# Altium schematic sheet jmb575.SchDoc
size A2; SheetNumber: 3; SheetTotal: 4
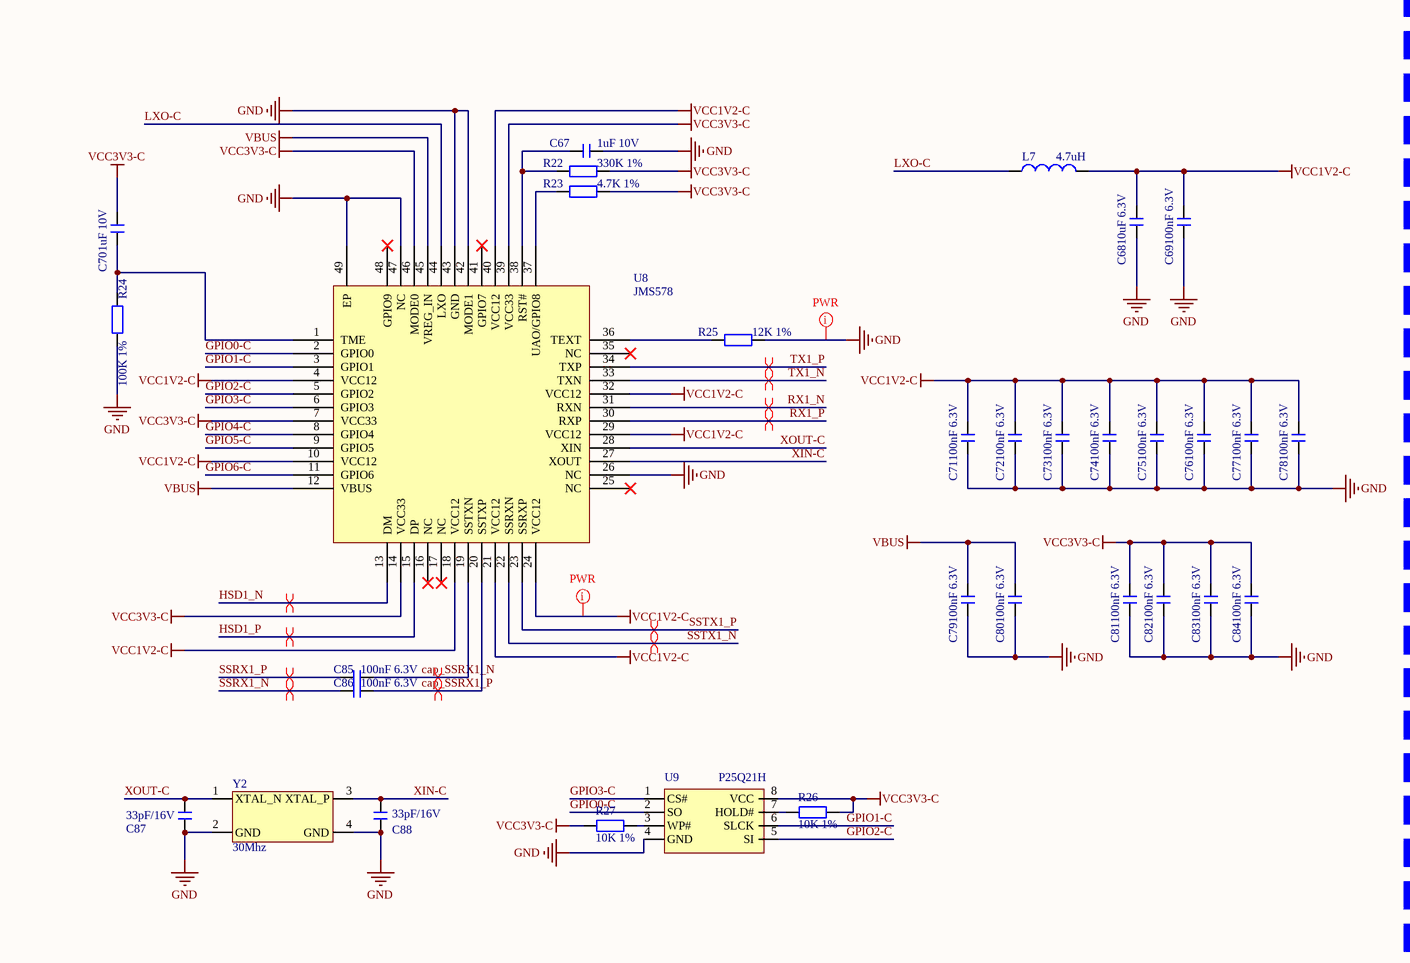
[diagram p0: jmb575.SchDoc, left]
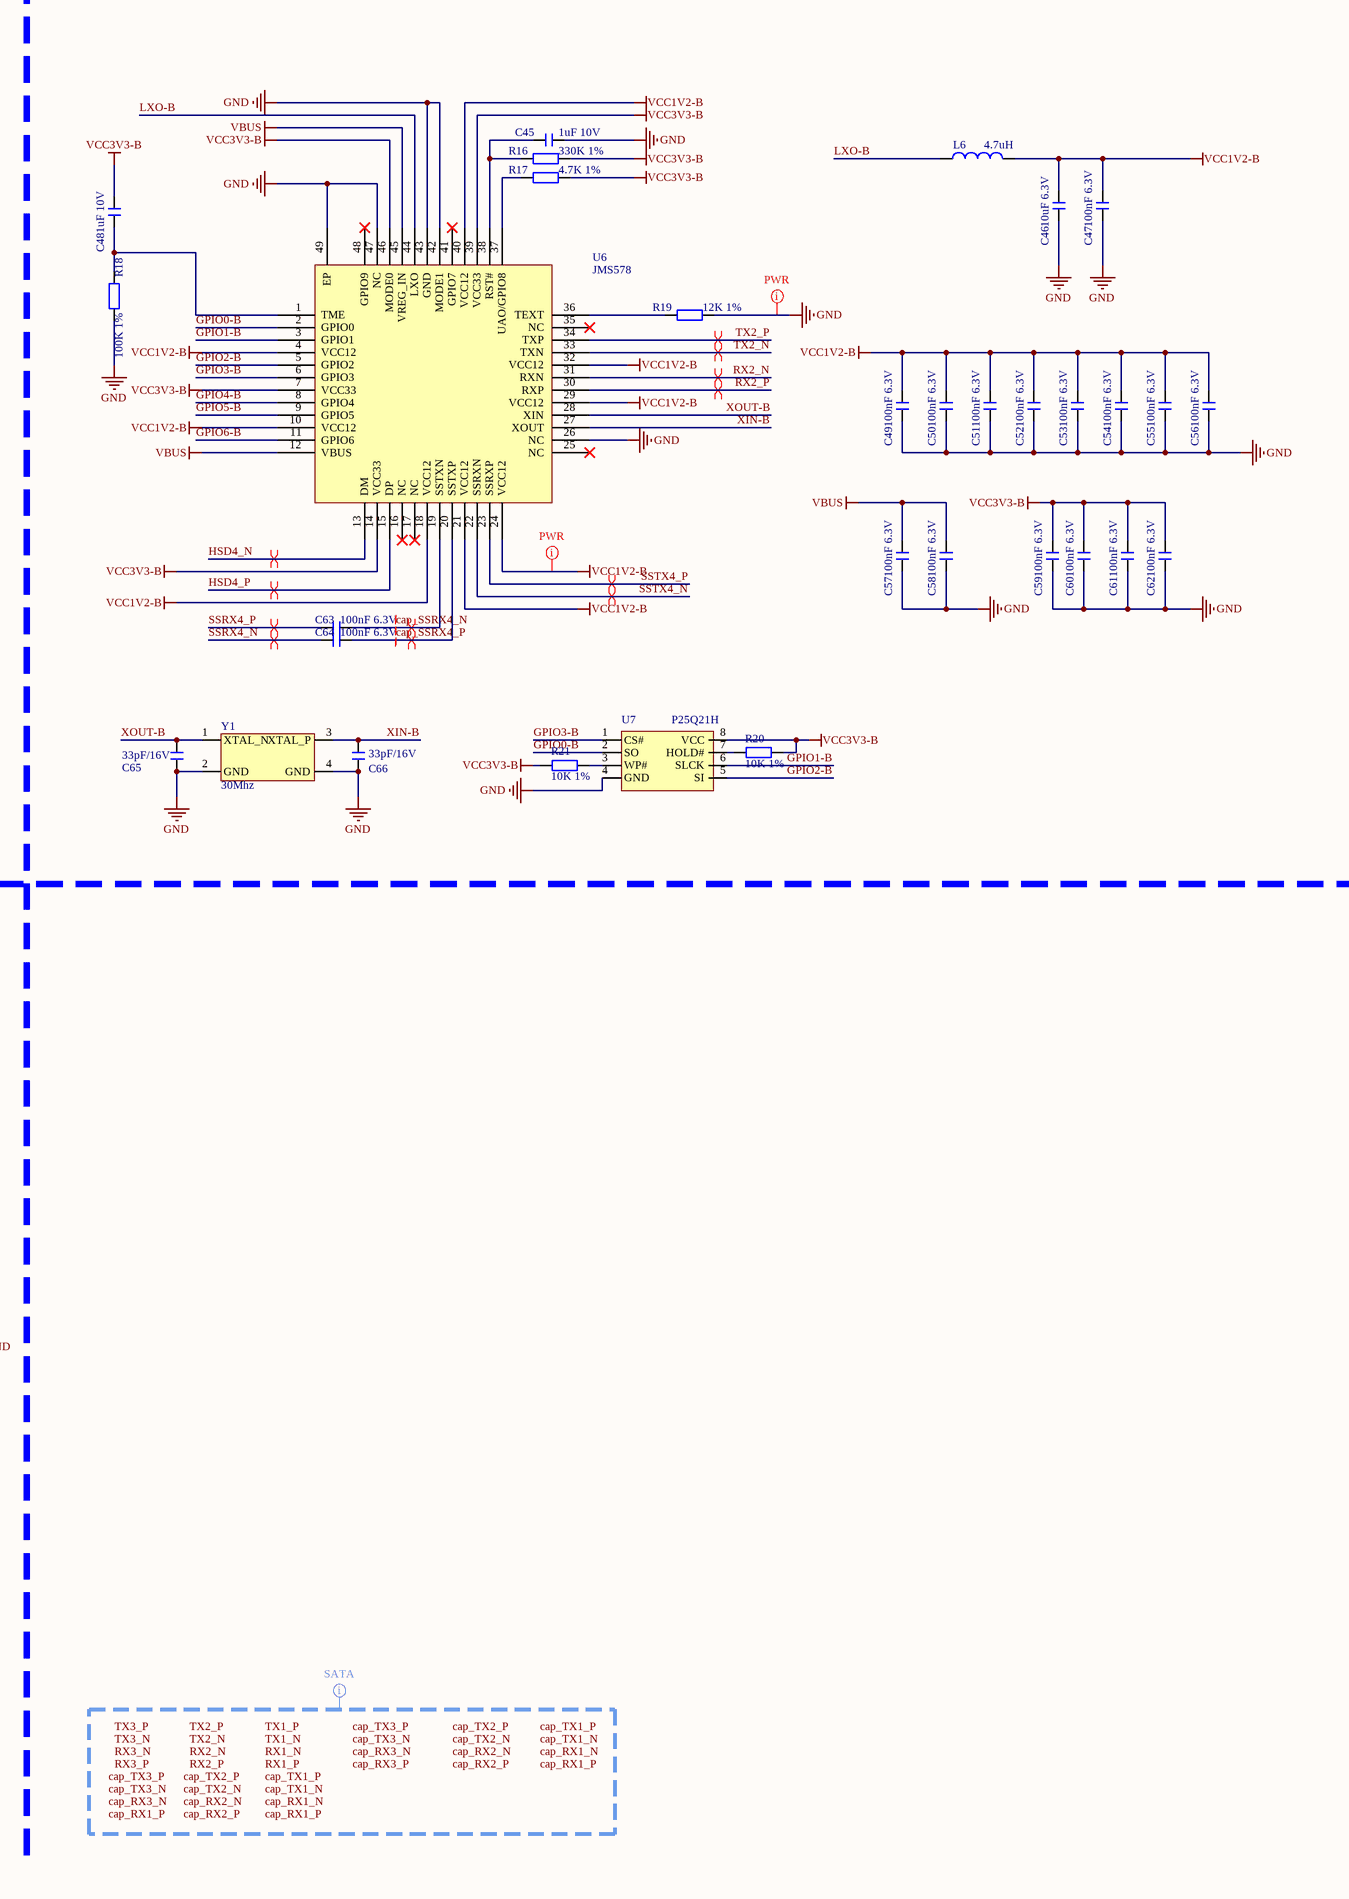
[diagram p1: jmb575.SchDoc, right]

## Parts
C45  1uF 10V  [C0402_L]
C46  10uF 6.3V  [C0603_L]
C47  100nF 6.3V  [C0402_L]
C48  1uF 10V  [C0402_L]
C49  100nF 6.3V  [C0402_L]
C50  100nF 6.3V  [C0402_L]
C51  100nF 6.3V  [C0402_L]
C52  100nF 6.3V  [C0402_L]
C53  100nF 6.3V  [C0402_L]
C54  100nF 6.3V  [C0402_L]
C55  100nF 6.3V  [C0402_L]
C56  100nF 6.3V  [C0402_L]
C57  100nF 6.3V  [C0402_L]
C58  100nF 6.3V  [C0402_L]
C59  100nF 6.3V  [C0402_L]
C60  100nF 6.3V  [C0402_L]
C61  100nF 6.3V  [C0402_L]
C62  100nF 6.3V  [C0402_L]
C63  100nF 6.3V  [C0402_L]
C64  100nF 6.3V  [C0402_L]
C65  33pF/16V  [C0402_L]
C66  33pF/16V  [C0402_L]
C67  1uF 10V  [C0402_L]
C68  10uF 6.3V  [C0603_L]
C69  100nF 6.3V  [C0402_L]
C70  1uF 10V  [C0402_L]
C71  100nF 6.3V  [C0402_L]
C72  100nF 6.3V  [C0402_L]
C73  100nF 6.3V  [C0402_L]
C74  100nF 6.3V  [C0402_L]
C75  100nF 6.3V  [C0402_L]
C76  100nF 6.3V  [C0402_L]
C77  100nF 6.3V  [C0402_L]
C78  100nF 6.3V  [C0402_L]
C79  100nF 6.3V  [C0402_L]
C80  100nF 6.3V  [C0402_L]
C81  100nF 6.3V  [C0402_L]
C82  100nF 6.3V  [C0402_L]
C83  100nF 6.3V  [C0402_L]
C84  100nF 6.3V  [C0402_L]
C85  100nF 6.3V  [C0402_L]
C86  100nF 6.3V  [C0402_L]
C87  33pF/16V  [C0402_L]
C88  33pF/16V  [C0402_L]
L6  4.7uH  [SMMS0420]
L7  4.7uH  [SMMS0420]
R16  330K 1%  [R0402_L]
R17  4.7K 1%  [R0402_L]
R18  100K 1%  [R0402_L]
R19  12K 1%  [R0402_L]
R20  10K 1%  [R0402_L]
R21  10K 1%  [R0402_L]
R22  330K 1%  [R0402_L]
R23  4.7K 1%  [R0402_L]
R24  100K 1%  [R0402_L]
R25  12K 1%  [R0402_L]
R26  10K 1%  [R0402_L]
R27  10K 1%  [R0402_L]
U6  JMS578  [QFN48-L6.0-W6.0-P0.4]
U7  P25Q21H  [SOP8_L]
U8  JMS578  [QFN48-L6.0-W6.0-P0.4]
U9  P25Q21H  [SOP8_L]
Y1  30Mhz  [OSC 3225-4P]
Y2  30Mhz  [OSC 3225-4P]

## Nets
GND: C45.1 C46.1 C47.1 C49.1 C50.1 C51.1 C52.1 C53.1 C54.1 C55.1 C56.1 C57.1 C58.1 C59.1 C60.1 C61.1 C62.1 C65.2 C66.2 C67.1 C68.1 C69.1 C71.1 C72.1 C73.1 C74.1 C75.1 C76.1 C77.1 C78.1 C79.1 C80.1 C81.1 C82.1 C83.1 C84.1 C87.2 C88.2 R18.1 R19.1 R24.1 R25.1 U6.26(NC) U6.42(MODE1) U6.43(GND) U6.47(NC) U6.49(EP) U7.4(GND) U8.26(NC) U8.42(MODE1) U8.43(GND) U8.47(NC) U8.49(EP) U9.4(GND) Y1.2(GND) Y1.4(GND) Y2.2(GND) Y2.4(GND)
VBUS: C57.2 C58.2 C79.2 C80.2 U6.12(VBUS) U6.45(VREG_IN) U8.12(VBUS) U8.45(VREG_IN)
VCC1V2-B: C46.2 C47.2 C49.2 C50.2 C51.2 C52.2 C53.2 C54.2 C55.2 C56.2 L6.2 U6.4(VCC12) U6.10(VCC12) U6.18(VCC12) U6.21(VCC12) U6.24(VCC12) U6.29(VCC12) U6.32(VCC12) U6.40(VCC12)
VCC1V2-C: C68.2 C69.2 C71.2 C72.2 C73.2 C74.2 C75.2 C76.2 C77.2 C78.2 L7.2 U8.4(VCC12) U8.10(VCC12) U8.18(VCC12) U8.21(VCC12) U8.24(VCC12) U8.29(VCC12) U8.32(VCC12) U8.40(VCC12)
VCC3V3-B: C48.2 C59.2 C60.2 C61.2 C62.2 R16.1 R17.1 R20.1 R21.1 U6.7(VCC33) U6.14(VCC33) U6.39(VCC33) U6.46(MODE0) U7.8(VCC)
VCC3V3-C: C70.2 C81.2 C82.2 C83.2 C84.2 R22.1 R23.1 R26.1 R27.2 U8.7(VCC33) U8.14(VCC33) U8.39(VCC33) U8.46(MODE0) U9.8(VCC)
cap_SSRX1_N: C85.2 U8.19(SSTXN)
cap_SSRX1_P: C86.2 U8.20(SSTXP)
cap_SSRX4_N: C63.2 U6.19(SSTXN)
cap_SSRX4_P: C64.2 U6.20(SSTXP)
GPIO0-B: U6.2(GPIO0) U7.2(SO)
GPIO0-C: U8.2(GPIO0) U9.2(SO)
GPIO1-B: U6.3(GPIO1) U7.6(SLCK)
GPIO1-C: U8.3(GPIO1) U9.6(SLCK)
GPIO2-B: U6.5(GPIO2) U7.5(SI)
GPIO2-C: U8.5(GPIO2) U9.5(SI)
GPIO3-B: U6.6(GPIO3) U7.1(CS#)
GPIO3-C: U8.6(GPIO3) U9.1(CS#)
GPIO4-B: U6.8(GPIO4)
GPIO4-C: U8.8(GPIO4)
GPIO5-B: U6.9(GPIO5)
GPIO5-C: U8.9(GPIO5)
GPIO6-B: U6.11(GPIO6)
GPIO6-C: U8.11(GPIO6)
HSD1_N: U8.13(DM)
HSD1_P: U8.15(DP)
HSD4_N: U6.13(DM)
HSD4_P: U6.15(DP)
LXO-B: L6.1 U6.44(LXO)
LXO-C: L7.1 U8.44(LXO)
RX1_N: U8.31(RXN)
RX1_P: U8.30(RXP)
RX2_N: U6.31(RXN)
RX2_P: U6.30(RXP)
SSRX1_N: C86.1
SSRX1_P: C85.1
SSRX4_N: C64.1
SSRX4_P: C63.1
SSTX1_N: U8.22(SSRXN)
SSTX1_P: U8.23(SSRXP)
SSTX4_N: U6.22(SSRXN)
SSTX4_P: U6.23(SSRXP)
TX1_N: U8.33(TXN)
TX1_P: U8.34(TXP)
TX2_N: U6.33(TXN)
TX2_P: U6.34(TXP)
XIN-B: C66.1 U6.27(XOUT) Y1.3(XTAL_P)
XIN-C: C88.1 U8.27(XOUT) Y2.3(XTAL_P)
XOUT-B: C65.1 U6.28(XIN) Y1.1(XTAL_N)
XOUT-C: C87.1 U8.28(XIN) Y2.1(XTAL_N)
NetC45_2: C45.2 R16.2 U6.38(RST#)
NetC48_1: C48.1 R18.2 U6.1(TME)
NetC67_2: C67.2 R22.2 U8.38(RST#)
NetC70_1: C70.1 R24.2 U8.1(TME)
NetR17_2: R17.2 U6.37(UAO/GPIO8)
NetR19_2: R19.2 U6.36(TEXT)
NetR20_2: R20.2 U7.7(HOLD#)
NetR21_2: R21.2 U7.3(WP#)
NetR23_2: R23.2 U8.37(UAO/GPIO8)
NetR25_2: R25.2 U8.36(TEXT)
NetR26_2: R26.2 U9.7(HOLD#)
NetR27_1: R27.1 U9.3(WP#)

Not connected (* = marked no-connect by the designer): U6 16(NC)* 17(NC)* 25(NC)* 35(NC)* 41(GPIO7)* 48(GPIO9)*; U8 16(NC)* 17(NC)* 25(NC)* 35(NC)* 41(GPIO7)* 48(GPIO9)*

## Layout directives
differential pair: cap_SSRX1_N, cap_SSRX1_P, cap_SSRX4_N, cap_SSRX4_P, HSD1_N, HSD1_P, HSD4_N, HSD4_P, RX1_N, RX1_P, RX2_N, RX2_P, SSRX1_N, SSRX1_P, SSRX4_N, SSRX4_P, SSTX1_N, SSTX1_P, SSTX4_N, SSTX4_P, TX1_N, TX1_P, TX2_N, TX2_P
net class PWR: GND, VCC1V2-B, VCC1V2-C
net class SATA; rule Differential Pairs Routing [Pref Gap = 6mil    Min Gap  = 6mil    Max Gap  = 6milPref Width = 4.29mil    Min Width  = 4.29mil    Max Width  = 4.29mil]; rule Routing Via Style [Pref Size = 0.4mm    Pref Hole Size = 0.3mm]: cap_RX1_N, cap_RX1_P, cap_RX2_N, cap_RX2_P, cap_RX3_N, cap_RX3_P, cap_TX1_N, cap_TX1_P, cap_TX2_N, cap_TX2_P, cap_TX3_N, cap_TX3_P, RX1_N, RX1_P, RX2_N, RX2_P, RX3_N, RX3_P, TX1_N, TX1_P, TX2_N, TX2_P, TX3_N, TX3_P

## Notes on the sheet
- Labels drawn without touching a wire or pin: cap_RX1_N, cap_RX1_P, cap_RX2_N, cap_RX2_P, cap_RX3_N, cap_RX3_P, cap_TX1_N, cap_TX1_P, cap_TX2_N, cap_TX2_P, cap_TX3_N, cap_TX3_P, RX1_N, RX1_P, RX2_N, RX2_P, RX3_N, RX3_P, TX1_N, TX1_P, TX2_N, TX2_P, TX3_N, TX3_P

## Library data of the parts
C45-C88 = C: 无极性贴片电容; 版权归属: 源创客; 材质: X7R; BOM名称: 无极性贴片电容; 学习资源: www.ooocke.com
L6 L7 = L: 小功率贴片电感; 版权归属: 源创客; BOM名称: 小功率贴片电感; 学习资源: www.ooocke.com
R16-R27 = R: 贴片电阻; 版权归属: 源创客; BOM名称: 贴片电阻; 学习资源: www.ooocke.com
U7 U9 = P25D40H
Y1 Y2 = Crystal